# Altium schematic sheet Regulator5V.SchDoc
size A4; SheetNumber: 3; SheetTotal: 8
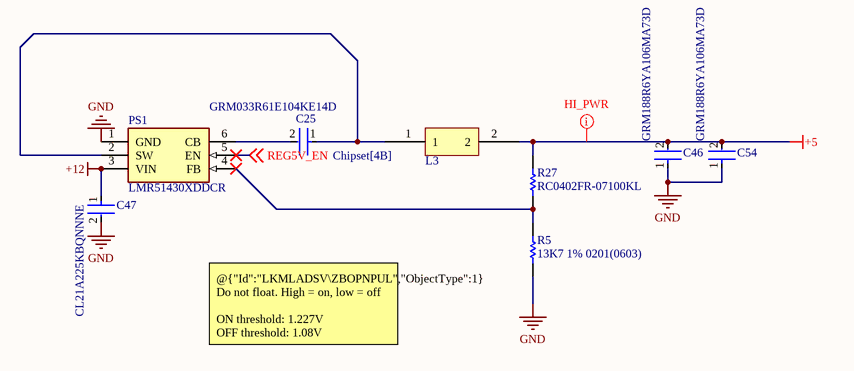
[diagram p0: Regulator5V.SchDoc]

## Parts
C25  GRM033R61E104KE14D  [FP-GRM033-0_03-IPC_B]
C46  GRM188R6YA106MA73D  [FP-GRM188-0_2-IPC_C]
C47  CL21A225KBQNNNE  [FP-CL21-IPC_B]
C54  GRM188R6YA106MA73D  [FP-GRM188-0_2-IPC_C]
L3  IHLP3232DZER5R6M11  [IHLP3232DZER5R6M11]  (value not drawn)
PS1  LMR51430XDDCR  [SOT95P280X110-6N]
R5  13K7 1% 0201(0603)  [RESC0201(0603)_N]
R27  RC0402FR-07100KL  [RESC1005X40X25NL05T10]

## Nets
+5: C46.2 C54.2 L3.2 R27.2
+12: C47.1 PS1.3(VIN)
GND: C46.1 C47.2 C54.1 PS1.1(GND) R5.1
REG5V_EN: PS1.5(EN) ; off-sheet REG5V_EN
NetC25_1: C25.1 L3.1 PS1.2(SW)
NetC25_2: C25.2 PS1.6(CB)
NetPS1_4: PS1.4(FB) R5.2 R27.1

## Layout directives
net class HI_PWR: +5

## Notes on the sheet
- @{"Id":"LKMLADSV\ZBOPNPUL","ObjectType":1}
  Do not float. High = on, low = off
  ON threshold: 1.227V
  OFF threshold: 1.08V

## Library data of the parts
C25 = CMP-06035-036234-1: Chip Multilayer Ceramic Capacitors for General Purpose, 0201, 0.10uF, X5R, 15%, 10%, 25V; Capacitance: 100nF; Case/Package: 0201; Mount: Surface Mount; Resistor Type: Ceramic; Package Quantity: 15000; Height: 0.3mm; Length: 0.024inch; Weight: 1.2E-05oz; Dielectric: X5R; Thickness: 0.013inch; Max Operating Temperature: 85°C; Case Code (Imperial): 0201; Voltage Rating: 25V; Case Code (Metric): 0603; Voltage Rating (DC): 25V; Width: 0.012inch; Termination: SMD/SMT; Tolerance: 10%; Min Operating Temperature: -55°C; Packaging: Tape and Reel; Lead Free: Lead Free
C46 C54 = CMP-06035-045466-1: Chip Multilayer Ceramic Capacitors for General Purpose, 0603, 10uF, X5R, 15%, 20%, 35V; Case Code (Imperial): 0603; Voltage Rating (DC): 35V; Width: 0.031inch; Dielectric: X5R; Voltage Rating: 35V; Min Operating Temperature: -55°C; Thickness: 0.039inch; Mount: Surface Mount; Case/Package: 0603; Length: 0.063inch; Capacitance: 10uF; Max Operating Temperature: 85°C; Packaging: Tape and Reel; Tolerance: 20%; Case Code (Metric): 1608
C47 = CMP-13271-004243-1: CL21 Series 0805 2.2uF 50V ±10% Tolerance X5R Multilayer Ceramic Chip Capacitor
PS1 = LMR51430XDDCR: Power Supply; Manufacturer_Name: Texas Instruments; Datasheet Link: https://www.ti.com/lit/ds/symlink/lmr51430.pdf?HQS=dis-mous-null-mousermode-dsf-pf-null-wwe&ts=1665567212982&ref_url=https%253A%252F%252Fwww.mouser.co.uk%252F; Height: 1.1mm; Manufacturer_Part_Number: LMR51430XDDCR; Mouser Part Number: 595-LMR51430XDDCR; Mouser Price/Stock: https://www.mouser.co.uk/ProductDetail/Texas-Instruments/LMR51430XDDCR?qs=vvQtp7zwQdP8miJIr5Aupg%3D%3D; Arrow Part Number: LMR51430XDDCR; Arrow Price/Stock: null?utm_currency=USD&region=nac
R5 = CMP-1010-00543-1: 13K7 0.05W 1% 0201 (0603 Metric)  SMD; Value: 13700.00 Ohm; Case-EIA: 0201; Case-Metric: 0603; Power: 0.05 W; Tolerance: 1 %; Technology: SMT
R27 = CMP-2002-07343-1: Manufacturer: Yageo / Phycomp; Part Number: RC0402FR-07100KL